# Altium schematic sheet Nguyen Quang Minh.SchDoc
size A0; SheetNumber: 1; SheetTotal: 1
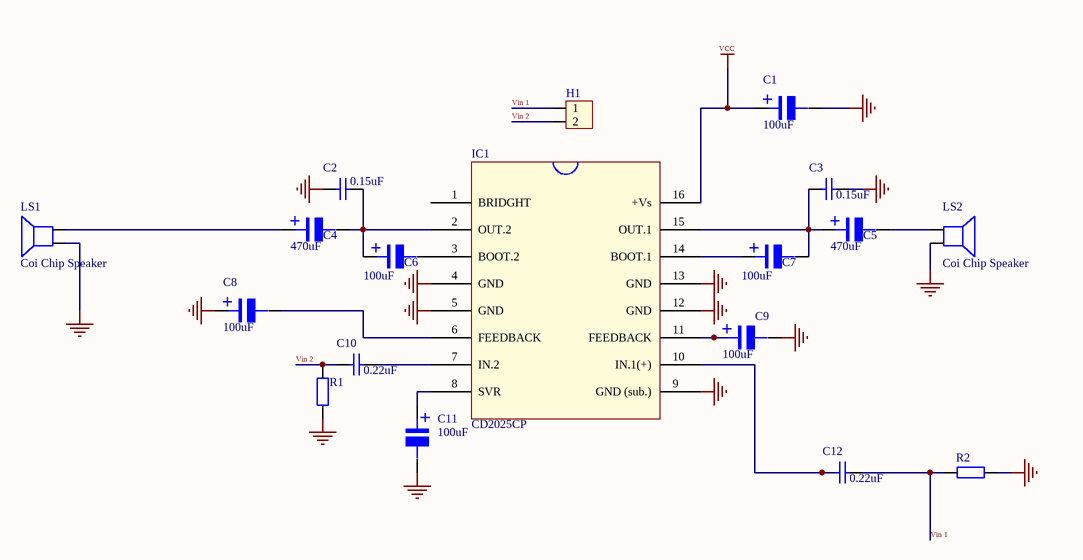
[diagram p0: Nguyen Quang Minh.SchDoc]

## Parts
C1  100uF  [tu nhom 8 (f)]
C2  0.15uF  [tu gom]
C3  0.15uF  [tu gom]
C4  470uF  [tu nhom 10 (G)]
C5  470uF  [tu nhom 10 (G)]
C6  100uF  [tu nhom 8 (f)]
C7  100uF  [tu nhom 8 (f)]
C8  100uF  [tu nhom 8 (f)]
C9  100uF  [tu nhom 8 (f)]
C10  0.22uF  [tu gom]
C11  100uF  [tu nhom 8 (f)]
C12  0.22uF  [tu gom]
H1  Header 2P 2.54 Duc Cong  [Header 2P DC 2.54]  (value not drawn)
IC1  CD2025CP  [CD2025CP]
LS1  Coi Chip Speaker  [Coi Chip Speacker]
LS2  Coi Chip Speaker  [Coi Chip Speacker]
R1  1k  [tro smd 0603]  (value not drawn)
R2  1k  [tro smd 0603]  (value not drawn)

## Nets
GND: C1.2 C2.2 C3.1 C8.1 C9.2 C11.2 IC1.4(GND) IC1.5(GND) IC1.9(GND_(sub.)) IC1.12(GND) IC1.13(GND) LS1.1 LS2.2 R1.1 R2.2
VCC: C1.1 IC1.16(+Vs)
Vin 1: C12.1 H1.1 R2.1
Vin 2: C10.2 H1.2 R1.2
NetC2_1: C2.1 C4.2 C6.1 IC1.2(OUT.2)
NetC3_2: C3.2 C5.1 C7.2 IC1.15(OUT.1)
NetC4_1: C4.1 LS1.2
NetC5_2: C5.2 LS2.1
NetC6_2: C6.2 IC1.3(BOOT.2)
NetC7_1: C7.1 IC1.14(BOOT.1)
NetC8_2: C8.2 IC1.6(FEEDBACK)
NetC9_1: C9.1 IC1.11(FEEDBACK)
NetC10_1: C10.1 IC1.7(IN.2)
NetC11_1: C11.1 IC1.8(SVR)
NetC12_2: C12.2 IC1.10(IN.1(+))

Not connected (* = marked no-connect by the designer): IC1 1(BRIDGHT)

## Notes on the sheet
- (in symbol Tu Nhom 100uF 50V) +
- (in symbol Tu Nhom 470uF 35V) +

## Library data of the parts
C1 C6-C9 C11 = Tu Nhom 100uF 50V: Dán; Don_Vi: Con; So_Chan: 2; Ten_Linh_Kien: Tụ Nhôm 100uF 50V 8x10.2MM; Ma_Hang: MH002223; Chung_Loai: Dán; Kieu_Chan: *
C2 C3 C10 C12 = Tu gom 15pF 50V: Cắm; Don_Vi: Con; So_Chan: 2; Ten_Linh_Kien: Tụ gốm 15P 50V; Ma_Hang: MH004767; Chung_Loai: Cắm; Kieu_Chan: *
C4 C5 = Tu Nhom 470uF 35V: Dán; Don_Vi: Con; So_Chan: 2; Ten_Linh_Kien: Tụ Nhôm 470uF 35V 10x10.5MM; Ma_Hang: MH004418; Chung_Loai: Dán; Kieu_Chan: *
H1 = Header 2P 2.54 Duc Cong: Cắm; Ten_Linh_Kien: Header 2P XH2.54-2P Đực Cong; Don_Vi: Con; Ma_Hang: MH002852; Chung_Loai: Cắm
LS1 LS2 = Coi Chip Speaker: Còi chip
R1 R2 = Tro 0603 1% 1k: Dán; So_Chan: 2; Don_Vi: Con; Ten_Linh_Kien: Trở 0603 1% 1k; Ma_Hang: MH006334; Chung_Loai: Dán; Kieu_Chan: *